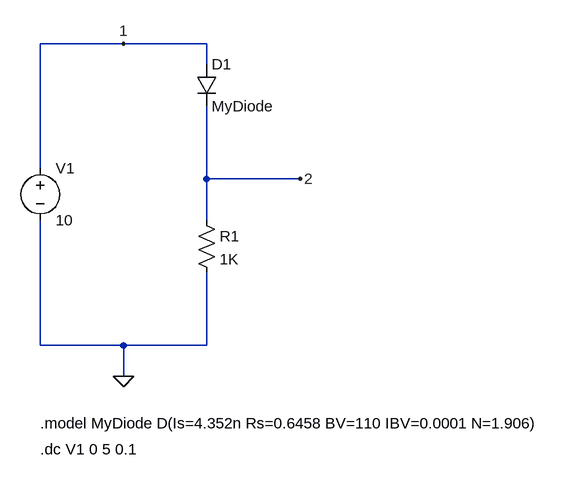
[diagram p0: schematic circuit_with_dc_sweep.asc]
circuit_with_dc_sweep.asc, the LTspice schematic file:
Version 4
SHEET 1 880 680
WIRE 160 0 32 0
WIRE 288 0 160 0
WIRE 288 32 288 0
WIRE 32 192 32 0
WIRE 288 208 288 96
WIRE 432 208 288 208
WIRE 288 272 288 208
WIRE 32 464 32 272
WIRE 160 464 32 464
WIRE 288 464 288 352
WIRE 288 464 160 464
WIRE 160 512 160 464
FLAG 160 512 0
FLAG 160 0 1
FLAG 432 208 2
SYMBOL voltage 32 176 R0
WINDOW 123 0 0 Left 0
WINDOW 39 0 0 Left 0
SYMATTR InstName V1
SYMATTR Value 10
SYMBOL res 272 256 R0
SYMATTR InstName R1
SYMATTR Value 1K
SYMBOL diode 272 32 R0
SYMATTR InstName D1
SYMATTR Value MyDiode
TEXT 32 584 Left 2 !.model MyDiode D(Is=4.352n Rs=0.6458 BV=110 IBV=0.0001 N=1.906)
TEXT 32 624 Left 2 !.dc V1 0 5 0.1

The netlist it stands for:
* circuit_with_dc_sweep.asc
V1 1 0 10
R1 2 0 1K
D1 1 2 MyDiode
.model D D
.lib standard.dio
.model MyDiode D(Is=4.352n Rs=0.6458 BV=110 IBV=0.0001 N=1.906)
.dc V1 0 5 0.1
.backanno
.end